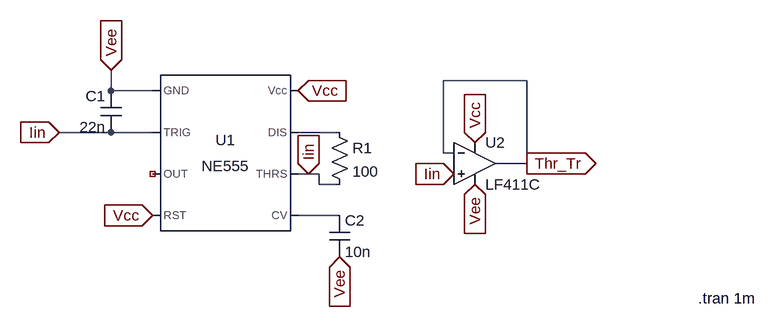
[diagram p0: schematic 555.asc]
555.asc, the LTspice schematic file:
Version 4
SHEET 1 1072 680
WIRE 704 48 576 48
WIRE 64 64 64 32
WIRE 128 64 64 64
WIRE 64 128 -16 128
WIRE 128 128 64 128
WIRE 416 128 352 128
WIRE 576 160 576 48
WIRE 592 160 576 160
WIRE 704 176 704 48
WIRE 704 176 656 176
WIRE 368 192 352 192
WIRE 384 192 368 192
WIRE 384 208 384 192
WIRE 416 208 384 208
WIRE 416 256 352 256
FLAG 352 64 Vcc
IOPIN 352 64 In
FLAG 128 256 Vcc
IOPIN 128 256 In
FLAG -16 128 Iin
IOPIN -16 128 In
FLAG 64 32 Vee
IOPIN 64 32 In
FLAG 624 144 Vcc
IOPIN 624 144 In
FLAG 624 208 Vee
IOPIN 624 208 In
FLAG 704 176 Thr_Tr
IOPIN 704 176 Out
FLAG 368 192 Iin
IOPIN 368 192 In
FLAG 592 192 Iin
IOPIN 592 192 In
FLAG 416 320 Vee
IOPIN 416 320 In
SYMBOL Misc\\NE555 240 160 R0
SYMATTR InstName U1
SYMBOL res 400 112 R0
SYMATTR InstName R1
SYMATTR Value 100
SYMBOL cap 80 128 R180
WINDOW 0 24 56 Left 2
WINDOW 3 24 8 Left 2
SYMATTR InstName C1
SYMATTR Value 22n
SYMBOL cap 400 256 R0
SYMATTR InstName C2
SYMATTR Value 10n
SYMBOL OpAmps\\opamp2 624 112 R0
SYMATTR InstName U2
SYMATTR Value LF411C
TEXT 968 384 Left 2 !.tran 1m

The netlist it stands for:
* 555.asc
XU1 Vee Iin NC_01 Vcc N002 Iin N001 Vcc NE555  ; pins GND TRIG OUT RST CV THRS DIS Vcc
R1 N001 Iin 100
C1 Iin Vee 22n
C2 N002 Vee 10n
XU2 Iin Thr_Tr Vcc Vee Thr_Tr LF411C  ; pins In+ In- V+ V- OUT
.tran 1m
.lib NE555.sub
.backanno
.end